# EAGLE design bleumaus-oshchip-mk-1.0.1 (EAGLE 9.3.1)
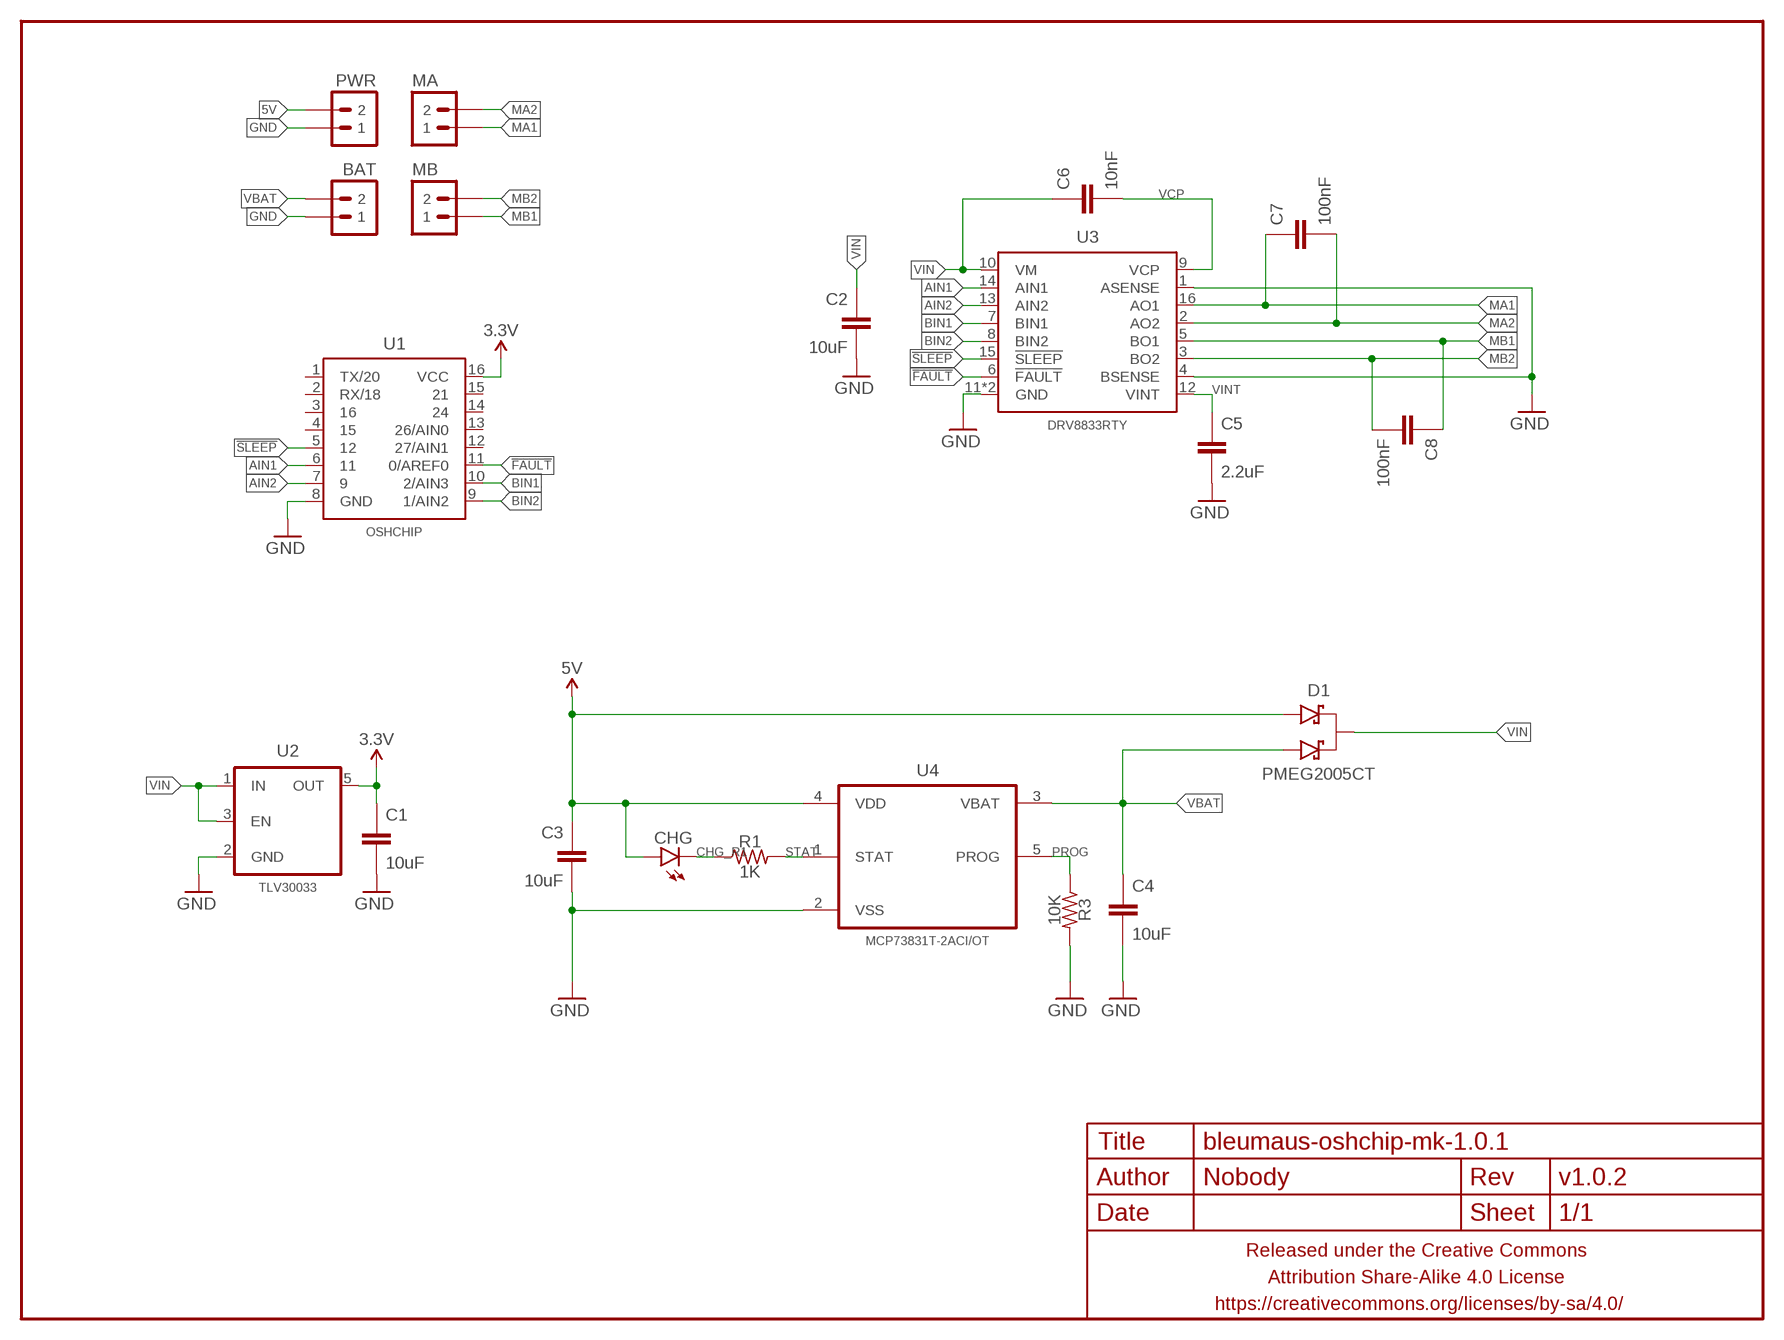
[diagram p0: schematic, sheet 1]

## Parts
BAT  M02PTH-2MM  [1X02-2MM-PTH]
C1  10uF  CAPACITOR-CERAMICC0402  [C0402]
C2  10uF  CAPACITOR-CERAMICC1206  [C1206]
C3  10uF  CAPACITOR-CERAMICC0402  [C0402]
C4  10uF  CAPACITOR-CERAMICC0402  [C0402]
C5  2.2uF  CAPACITOR-CERAMICC0402  [C0402]
C6  10nF  CAPACITOR-CERAMICC0402  [C0402]
C7  100nF  CAPACITOR-CERAMICC0402  [C0402]
C8  100nF  CAPACITOR-CERAMICC0402  [C0402]
CHG  LED0603-TIGHT  [LED-0603-TIGHT]
D1  PMEG2005CT  DIODE-SCHOTTKY-DUALPMEG2005CT  [SOT23]
FRAME1  FRAME-LETTERNO_PACKAGE  [DUMMY]
MA  M02PTH-2MM  [1X02-2MM-PTH]
MB  M02PTH-2MM  [1X02-2MM-PTH]
PWR  M02PTH-2MM  [1X02-2MM-PTH]
R1  1K  RESISTORR0402  [R0402]
R3  10K  RESISTORR0402  [R0402]
U1  OSHCHIP  [DIL16]
U2  TLV30033  V_REG_ENTLV700XXDCK-TIGHTER  [SC70-TIGHTER]
U3  DRV8833RTY  [PWQFN-16]
U4  MCP73831T-2ACI/OT  [SOT95P280X145-5N]

## Nets
3.3V: C1.1 U1.16(VCC) U2.5(OUT)
5V: C3.1 CHG.A D1.1(A1) PWR.P$2 U4.4(VDD)
!FAULT: U1.11(0/AREF0) U3.6(!FAULT)
!SLEEP: U1.5 U3.15(!SLEEP)
AIN1: U1.6 U3.14(AIN1)
AIN2: U1.7 U3.13(AIN2)
BIN1: U1.10(2/AIN3) U3.7(BIN1)
BIN2: U1.9(1/AIN2) U3.8(BIN2)
CHG_R1: CHG.C R1.1
GND: BAT.P$1 C1.2 C2.2 C3.2 C4.2 C5.2 PWR.P$1 R3.2 U1.8(GND) U2.2(GND) U3.1(ASENSE) U3.4(BSENSE) U3.11(GND) U3.17(GND) U4.2(VSS)
MA1: C7.1 MA.P$1 U3.16(AO1)
MA2: C7.2 MA.P$2 U3.2(AO2)
MB1: C8.1 MB.P$1 U3.5(BO1)
MB2: C8.2 MB.P$2 U3.3(BO2)
PROG: R3.1 U4.5(PROG)
STAT: R1.2 U4.1(STAT)
VBAT: BAT.P$2 C4.1 D1.2(A2) U4.3(VBAT)
VCP: C6.2 U3.9(VCP)
VIN: C2.1 C6.1 D1.3(K) U2.1(IN) U2.3(EN) U3.10(VM)
VINT: C5.1 U3.12(VINT)
Unconnected: U1.1(TX/20) U1.2(RX/18) U1.3 U1.4 U1.12(27/AIN1) U1.13(26/AIN0) U1.14 U1.15

## Library data of the parts
BAT MA MB PWR = a_parts:M02: Standard 2-pin 0.1" header. Use with - straight break away headers ( PRT-00116) - right angle break away headers (PRT-00553) - swiss pins (PRT-00743) - machine pins (PRT-00117) - female headers (PRT-00115) Molex polarized connector foot print use with: PRT-08233 with associated crimp pins and housings. 2.54_SCREWTERM for use with PRT-10571. 3.5mm Screw Terminal footprints for PRT-08084 5mm Screw Terminal footprints for use with PRT-08433
C1-C8 = a_parts:CAPACITOR-CERAMIC: CAPACITOR, European symbol
CHG = a_parts:LED: LEDs Standard schematic elements and footprints for 5mm, 3mm, 1206, and 0603 sized LEDs. 5mm - Spark Fun Electronics SKU : COM-00529 (and others)
D1 = a_parts:DIODE-SCHOTTKY-DUAL
FRAME1 = a_parts:FRAME-LETTER: Schematic Frame Standard 8.5x11 US Letter frame; DESIGNER: Nobody; VERSION: v1.0.2
R1 R3 = a_parts:RESISTOR: RESISTOR, American symbol
U1 = a_parts:OSHCHIP
U2 = a_parts:V_REG_EN
U3 = a_parts:DRV8833
U4 = a_parts:MCP73831T-2ACI/OT: Charge Management Controller; MPN: MCP73831T-2ACI/OT; OC_FARNELL: 1332158; OC_NEWARK: 56K7045; PACKAGE: SOT-5; SUPPLIER: Microchip

## Board
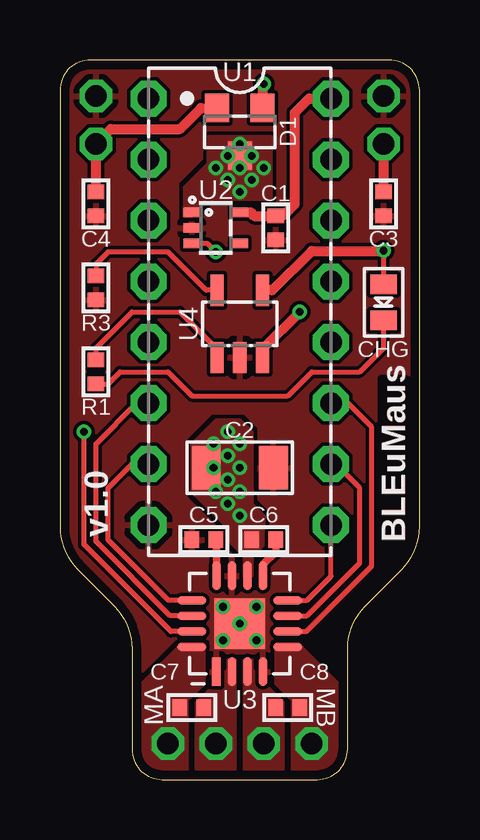
[diagram p1: board, top side]
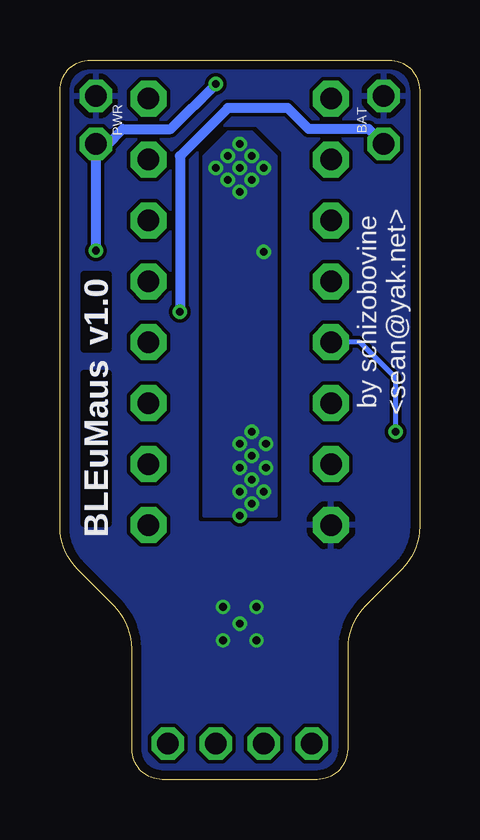
[diagram p2: board, bottom side, seen from below]

Size 15 x 30 mm. Coordinates in mm from the lower left corner, seen from the top.
Outline: 4.27,0 10.73,0 arc90 12,1.27 12,5.45 arc-45 12.74,7.24 14.26,8.76 arc45 15,10.55 15,28.73 arc90 13.73,30 1.27,30 arc90 0,28.73 0,10.55 arc45 0.74,8.76 2.26,7.24 arc-45 3,5.45 3,1.27 arc90 4.27,0
Copper layers (1*16): Top 0.035559375mm / dielectric 1.6mm / Bottom 0.035559375mm
Design rules "oshpark-2layer": minimum track width 6mil, minimum drill 10mil, track to track 6mil, track to pad 6mil, pad to pad 6mil, via to via 6mil, smd to smd 0mil, copper to edge 15mil, drill to drill 6mil, minimum pad ring 5mil, minimum via ring 5mil, stop-mask expansion 2.5mil, vias tented up to drill 20mil, thermal gap 10mil

### Footprints (pad centres in the part's own frame; a part is rotated, then mirrored left to right if it is on the bottom)
1X02-2MM-PTH = drill 0.9 octagon: P$1 -1,0; P$2 1,0
C0402 = smd 0.6 x 0.7: 1 -0.5,0; 2 0.5,0
C1206 = smd 1.2 x 1.8: 1 -1.4,0; 2 1.4,0
LED-0603-TIGHT = smd 0.8 x 1.1: A 0.75,0; C -0.75,0
SOT23 = smd 1 x 1.2: 1 -0.95,-1; 2 0.95,-1; 3 0,1
R0402 = smd 0.6 x 0.7: 1 -0.5,0; 2 0.5,0
DIL16 = drill 0.9 pad 1.5 octagon: 1 -8.89,-3.81; 2 -6.35,-3.81; 3 -3.81,-3.81; 4 -1.27,-3.81; 5 1.27,-3.81; 6 3.81,-3.81; 7 6.35,-3.81; 8 8.89,-3.81; 9 8.89,3.81; 10 6.35,3.81; 11 3.81,3.81; 12 1.27,3.81; 13 -1.27,3.81; 14 -3.81,3.81; 15 -6.35,3.81; 16 -8.89,3.81
SC70-TIGHTER = smd 0.4 x 0.7: 1 -0.65,-1; 2 0,-1; 3 0.65,-1; 4 0.65,1; 5 -0.65,1
PWQFN-16 = smd 0.35 x 1.2: 1 -0.975,-2; 2 -0.325,-2; 3 0.325,-2; 4 0.975,-2; 9 0.975,2; 10 0.325,2; 11 -0.325,2; 12 -0.975,2 | smd 1.2 x 0.35: 5 2,-0.975; 6 2,-0.325; 7 2,0.325; 8 2,0.975; 13 -2,0.975; 14 -2,0.325; 15 -2,-0.325; 16 -2,-0.975 | smd 2.1 x 2.1: 17 0,0
SOT95P280X145-5N = smd 1.3 x 0.55: 1 -1.4,0.95; 2 -1.4,0; 3 -1.4,-0.95; 4 1.4,-0.95; 5 1.4,0.95

### Placement (x,y rotation side)
BAT  1.5,27.5 270 bottom
C1  9,23 270 top
C2  7.5,13 0 top
C3  13.5,24 270 top
C4  1.5,24 270 top
C5  6,10 180 top
C6  8.5,10 0 top
C7  5.5,3 0 top
C8  9.5,3 180 top
CHG  13.5,19.9 90 top
D1  7.5,27 180 top
FRAME1  0,0 0 top
MA  5.5,1.5 0 top
MB  9.5,1.5 180 top
PWR  13.5,27.5 270 bottom
R1  1.5,17 90 top
R3  1.5,20.5 270 top
U1  7.5,19.5 270 top
U2  6.5,23 270 top
U3  7.5,6.5 0 top
U4  7.5,19 90 top

### Tracks (layer width: path | path; a pad name or v marks a point on that pad's centre or on a via)
3.3V
  Top 0.406: U2.5 7.95,23.65 8.1,23.5 C1.1 9.3,23.5 9.8,24 9.8,27.8 10.39,28.39 U1.16
5V  (via drill 0.33)
  Top 0.2: CHG.A 13.5,22.03 v13.49,22.04
  Top 0.406: U4.4 8.86,20.4 10.5,22.04 v13.49,22.04 v13.5,22.05 | C3.1 PWR.P$2 | v8.5,29 8.45,28.95 D1.1
  Bottom 0.406: v8.5,29 10.38,27.12 12.38,27.12 13,26.5 PWR.P$2 v13.5,22.05
!FAULT
  Top 0.2: U3.6 10.28,6.17 13,8.9 13,14.69 12,15.69 U1.11
!SLEEP  (via drill 0.33)
  Top 0.2: U3.15 4.62,6.17 1,9.8 v1,14.5
  Bottom 0.2: v1,14.5 1,16.73 2.5,18.23 U1.5
AIN1
  Top 0.2: U3.14 4.6,6.83 1.5,9.93 1.5,14 3.19,15.69 U1.6
AIN2
  Top 0.2: U3.13 4.53,7.47 2,10 2,12.15 3,13.15 U1.7
BIN1
  Top 0.2: U3.7 10.3,6.83 12.5,9.03 12.5,12.15 11.5,13.15 U1.10
BIN2
  Top 0.2: U3.8 10.31,7.47 11.31,8.47 U1.9
CHG_R1
  Top 0.2: R1.1 2,16.5 2.5,17 4.5,17 5.5,16 9.5,16 10.5,17 12.5,17 13.5,18 CHG.C
GND  (via drill 0.33)
  other vias: 7.5,6.5 6.8,5.8 8.2,5.8 6.8,7.2 8.2,7.2
  pour Top (rank 6): 0,30 0,0 15,0 15,30
  pour Bottom (rank 6): 0,30 0,0 15,0 15,30
MA1
  pour Top (rank 4, no thermals): 3,0 3,3.6 5,5.6 6,5.6 6,4 5.3,3.3 5.3,0
MA2
  pour Top (rank 5, no thermals): 7.3,5 7.3,0 5.7,0 5.7,3.3 7,4.6 7,5
MB1
  pour Top (rank 4, no thermals): 9.7,0 9.7,3.3 9,4 9,5.6 10,5.6 12,3.6 12,0
MB2
  pour Top (rank 5, no thermals): 7.7,5 8,5 8,4.6 9.3,3.3 9.3,0 7.7,0
PROG
  Top 0.2: U4.5 6.1,20.4 4.5,22 2,22 1.5,21.5 R3.1
STAT
  Top 0.2: R1.2 1.5,18 3,19.5 5,19.5 6.55,17.95 U4.1
VBAT  (via drill 0.33)
  Top 0.406: D1.2 5.88,28 5,27.12 2.12,27.12 BAT.P$2 C4.1 | U4.3 8.45,17.95 v10,19.5
  Bottom 0.406: BAT.P$2 2.12,27.12 4.62,27.12 5.5,28 8,28 10,26 v10,19.5
VCP
  Top 0.305: U3.9 8.47,8.97 9,9.5 C6.2
VIN  (via drill 0.33)
  Top 0.2: v6.5,22 6.15,22.35 U2.3
  other vias: 7.5,12 7.5,13 7.5,14 7,12.5 7,13.5 7.5,26.5 7,26 8,26 7.5,25.5 8.5,25.5 6.5,25.5 7,25 7.5,24.5 8,25 7,11.5 7.5,11 6.5,12 6.4,13 6.4,14 7,14.5
  pour Top (rank 4, no thermals): 7.7,8.5 8,8.5 8,9.3 8.5,9.8 8.5,11 8,11.5 8,14.5 7.5,15 6.5,15 5.5,14 5.5,12 7,10.5 7,10 7.7,9.3
  pour Top (rank 4, no thermals): 6.2,26.8 8.8,26.8 8.8,24.2 6.2,24.2 5.5,23.5 5.2,23.5 5.2,24.7 6.2,25.7
  pour Bottom (rank 4, no thermals): 6,11 6,26 7,27 8,27 9,26 9,11
VINT
  Top 0.305: U3.12 6.53,9.97 C5.1

### Text on the board
Top: BLEuMaus
Bottom: BLEuMaus
tPlace: BLEuMaus
bPlace: by schizobovine / <sean@yak.net> | BLEuMaus